# EAGLE schematic carret (EAGLE 5.11)
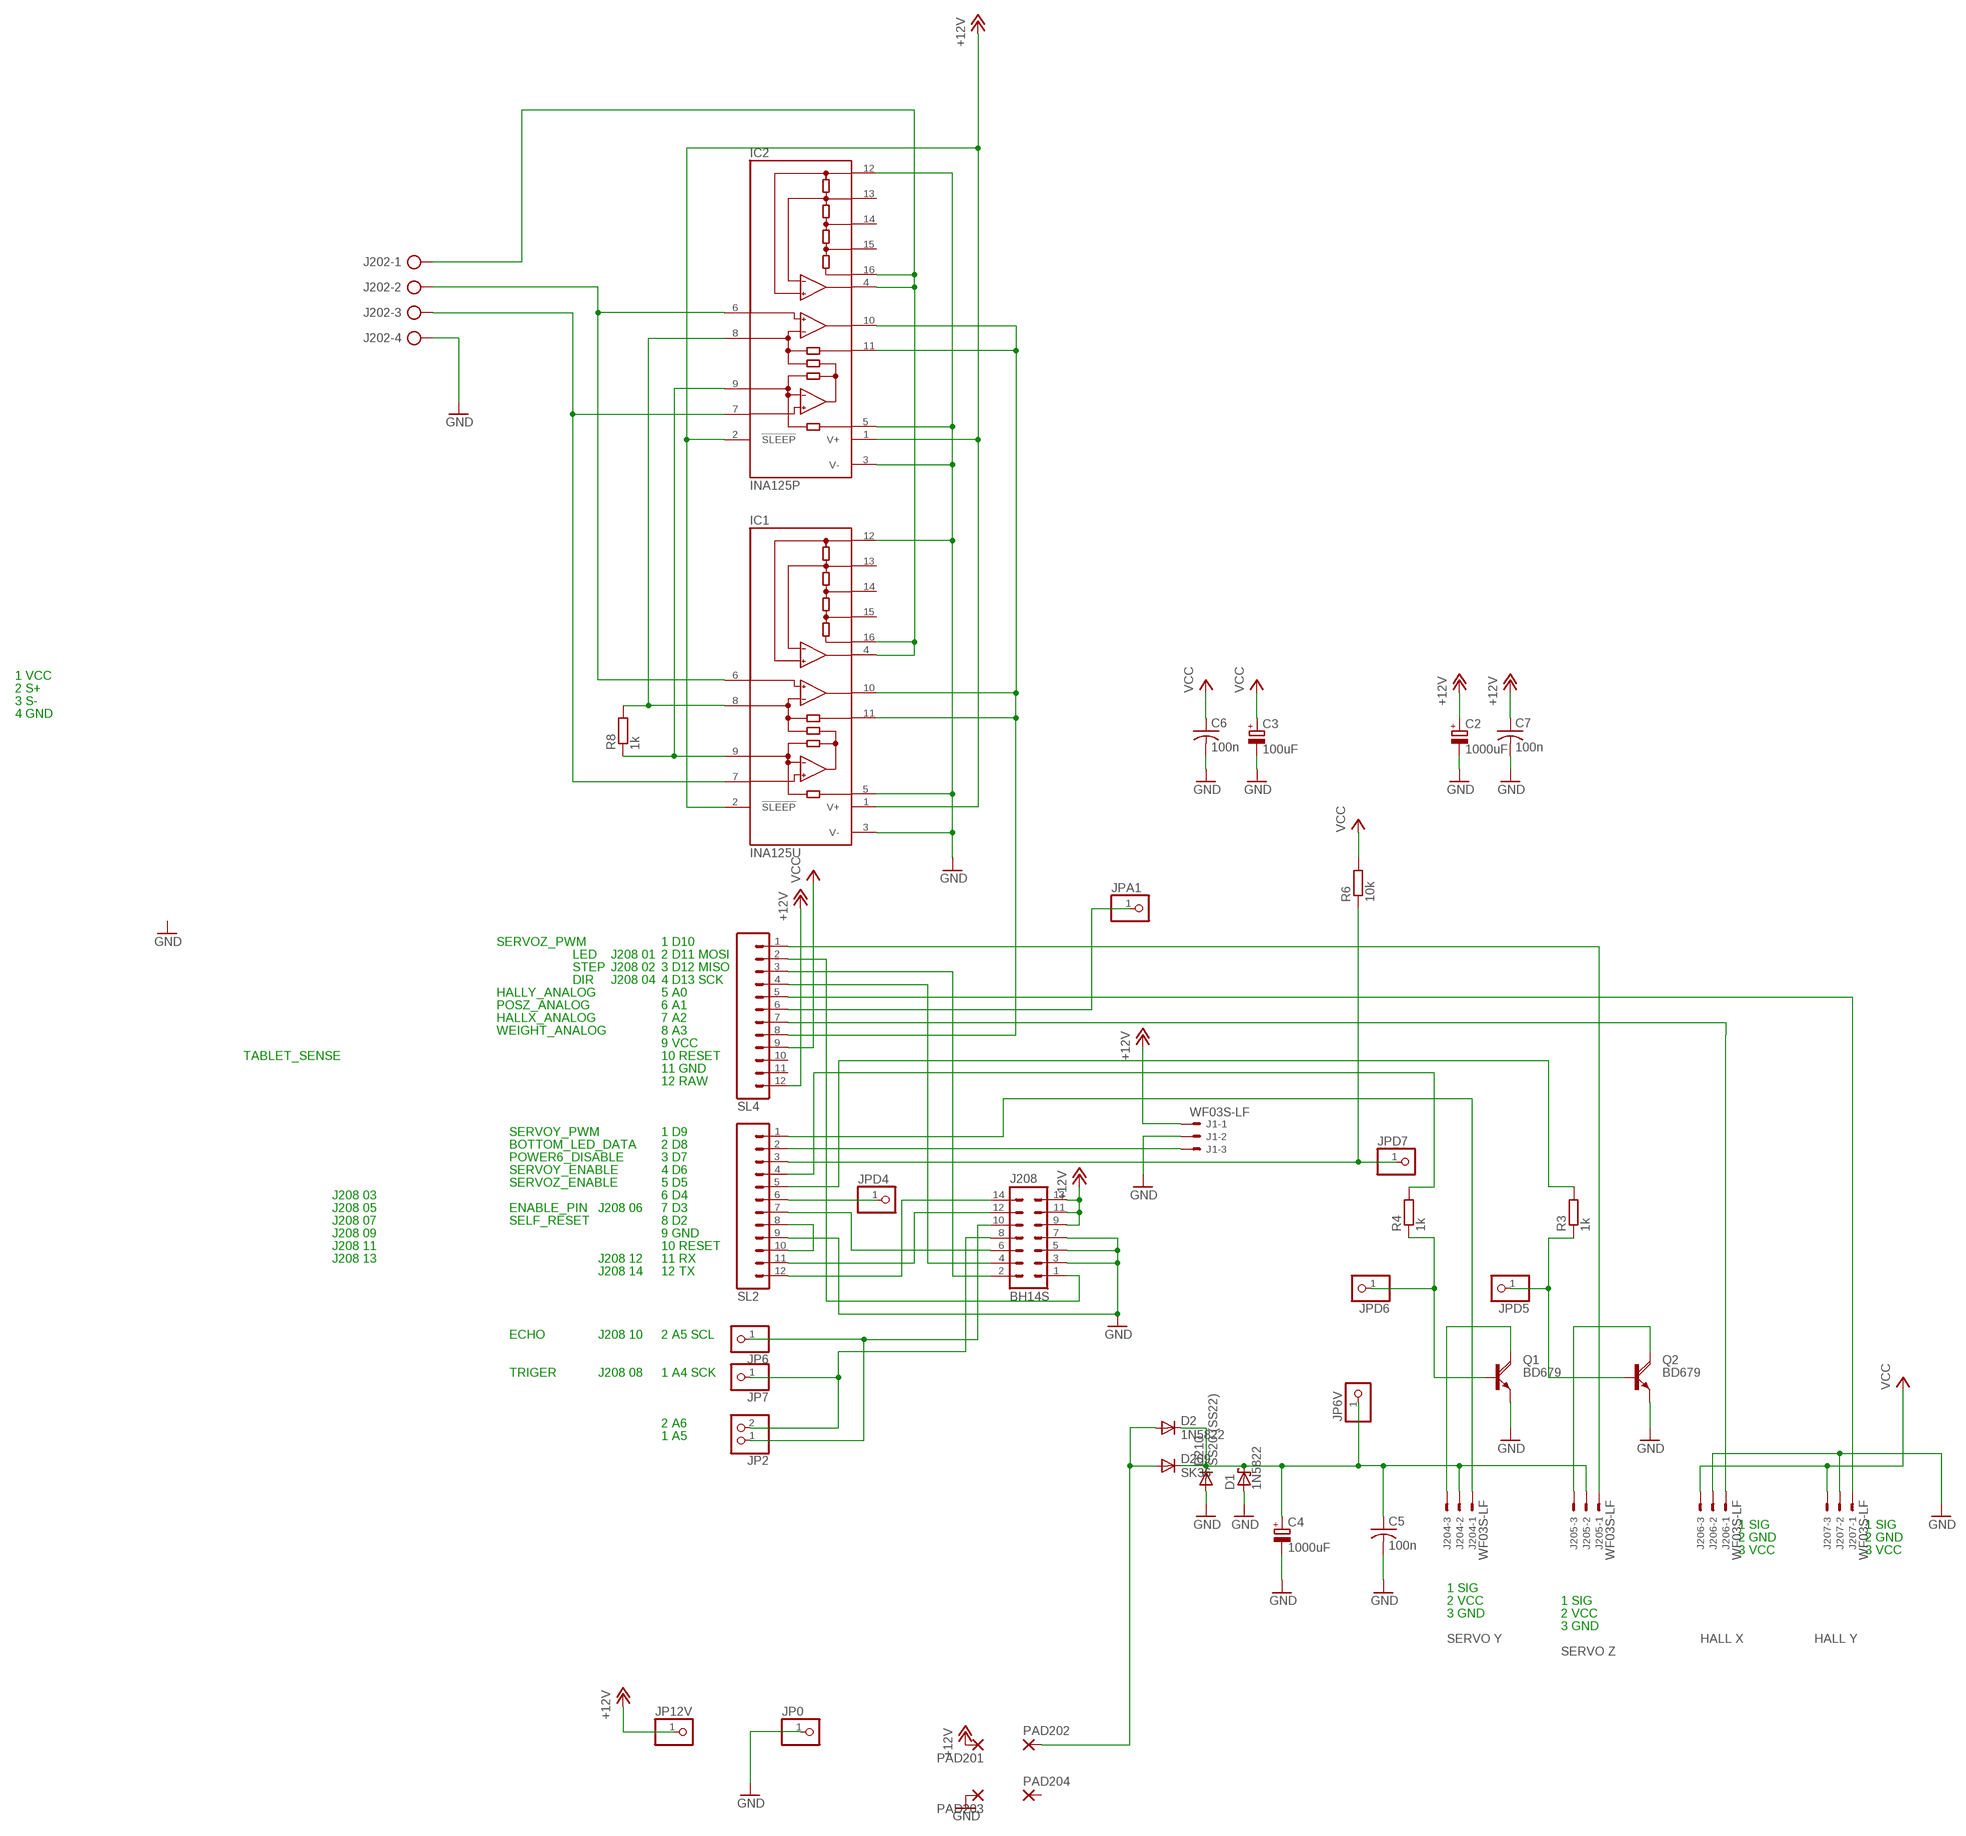
[diagram p0: schematic, sheet 1]

## Parts
C2  1000uF  CPOL-EUE3.5-8  [E3,5-8]
C3  100uF  CPOL-EUE3.5-8  [E3,5-8]
C4  1000uF  CPOL-EUE5-10.5  [E5-10,5]
C5  100n  C-US050-030X075  [C050-030X075]
C6  100n  C-US050-030X075  [C050-030X075]
C7  100n  C-US050-030X075  [C050-030X075]
D1  1N5822  1N5819-T  [DO41-7.6]
D2  1N5822  DIODE-DO201-15  [DO201-15]
D209  SK36  DIODE-SMC  [SMC]
D210  SS20 (SS22)  DIODE-DO214AA  [DO214AA]
IC1  INA125U  [SO16-1]
IC2  INA125P  [DIL16]
J1  WF03S-LF  22-27-2031-03  [6410-03]
J202  AK300/4  [AK300/4]
J204  WF03S-LF  22-27-2031-03  [6410-03]
J205  WF03S-LF  22-27-2031-03  [6410-03]
J206  WF03S-LF  22-27-2031-03  [6410-03]
J207  WF03S-LF  22-27-2031-03  [6410-03]
J208  BH14S  ML14  [ML14]
JP0  PINHD-1X1  [1X01]
JP2  PINHD-1X2  [1X02]
JP6  PINHD-1X1  [1X01]
JP6V  PINHD-1X1  [1X01]
JP7  PINHD-1X1  [1X01]
JP12V  PINHD-1X1  [1X01]
JPA1  PINHD-1X1  [1X01]
JPD4  PINHD-1X1  [1X01]
JPD5  PINHD-1X1  [1X01]
JPD6  PINHD-1X1  [1X01]
JPD7  PINHD-1X1  [1X01]
PAD201  3,81/1,1  [3,81/1,1]
PAD202  3,81/1,1  [3,81/1,1]
PAD203  3,81/1,1  [3,81/1,1]
PAD204  3,81/1,1  [3,81/1,1]
Q1  BD679  [TO126AV]
Q2  BD679  [TO126AV]
R3  1k  R-EU_0207/10  [0207/10]
R4  1k  R-EU_0207/10  [0207/10]
R6  10k  R-EU_0207/10  [0207/10]
R8  1k  R-EU_0207/10  [0207/10]
SL2  M12  [12P]
SL4  M12  [12P]

## Nets
+12V [power12]: C2.+ C7.1 IC1.1(V+) IC1.2(!SLEEP) IC2.1(V+) IC2.2(!SLEEP) J1.1 J208.9 J208.11 J208.13 JP12V.1 PAD201.1(P) SL4.12
GND [ground]: C2.- C3.- C4.- C5.2 C6.2 C7.2 D1.A D210.A IC1.3(V-) IC1.5(REF) IC1.12(REFCOM) IC2.3(V-) IC2.5(REF) IC2.12(REFCOM) J1.2 J202.4 J206.2 J207.2 J208.3 J208.5 J208.7 JP0.1 PAD203.1(P) Q1.E Q2.E SL2.9
N$1: JPD6.1 Q1.B R4.1
N$2: J208.14 SL2.12
N$3: J1.3 SL2.2
N$4: JPD7.1 R6.1 SL2.3
N$5: J206.1 SL4.7
N$6: J208.1 SL4.2
N$7: J208.12 SL2.11
N$8: J208.2 SL4.3
N$9: J208.10 JP2.1 JP6.1
N$10: J205.1 SL4.1
N$11: J208.8 JP2.2 JP7.1
N$12: J208.4 SL4.4
N$13: IC1.6(+IN) IC2.6(+IN) J202.2
N$14 [power12]: D2.A D209.A PAD202.1(P)
N$15: SL2.8 SL2.10
N$16: J207.1 SL4.5
N$17 [power6]: J204.3 Q1.C
N$18: R4.2 SL2.4
N$19: R3.2 SL2.5
N$20 [power6]: J205.3 Q2.C
N$21: J204.1 SL2.1
N$22 [power6]: C4.+ C5.1 D1.C D2.C D209.C D210.C J204.2 J205.2 JP6V.1
N$23: JPD5.1 Q2.B R3.1
N$24: JPD4.1 SL2.6
N$25: IC1.4(REFOUT) IC1.16(REF10) IC2.4(REFOUT) IC2.16(REF10) J202.1
N$26: IC1.7(-IN) IC2.7(-IN) J202.3
N$27: J208.6 SL2.7
N$28: JPA1.1 SL4.6
N$30: IC1.8(RG) IC2.8(RG) R8.2
N$31: IC1.9(RG) IC2.9(RG) R8.1
N$41: IC1.10(OUT) IC1.11(SENSE) IC2.10(OUT) IC2.11(SENSE) SL4.8
VCC [power5]: C3.+ C6.1 J206.3 J207.3 R6.2 SL4.9
Unconnected: IC1.13(REFBG) IC1.14(REF2.5) IC1.15(REF5) IC2.13(REFBG) IC2.14(REF2.5) IC2.15(REF5) PAD204.1(P) SL4.10 SL4.11

## Notes on the sheet
- 1 VCC
- 2 S+
- 3 S-
- 4 GND
- SERVOZ_PWM | 1 D10
- LED | J208 01 | 2 D11 MOSI
- STEP | J208 02 | 3 D12 MISO
- DIR | J208 04 | 4 D13 SCK
- HALLY_ANALOG | 5 A0
- POSZ_ANALOG | 6 A1
- HALLX_ANALOG | 7 A2
- WEIGHT_ANALOG | 8 A3
- 9 VCC
- TABLET_SENSE | 10 RESET
- 11 GND
- 12 RAW
- SERVOY_PWM | 1 D9
- BOTTOM_LED_DATA | 2 D8
- POWER6_DISABLE | 3 D7
- SERVOY_ENABLE | 4 D6
- SERVOZ_ENABLE | 5 D5
- J208 03 | 6 D4
- J208 05 | ENABLE_PIN | J208 06 | 7 D3
- J208 07 | SELF_RESET | 8 D2
- J208 09 | 9 GND
- J208 11 | 10 RESET
- J208 13 | J208 12 | 11 RX
- J208 14 | 12 TX
- ECHO | J208 10 | 2 A5 SCL
- TRIGER | J208 08 | 1 A4 SCK
- 2 A6
- 1 A5
- 1 SIG | 1 SIG
- 2 GND | 2 GND
- 3 VCC | 3 VCC
- 1 SIG
- 2 VCC | 1 SIG
- 3 GND | 2 VCC
- 3 GND
- SERVO Y | HALL X | HALL Y
- SERVO Z

## Library data of the parts
C2-C4 = rcl:CPOL-EU: POLARIZED CAPACITOR, European symbol
C5-C7 = resistor:C-US: CAPACITOR, American symbol
D1 = diode:1N581*: 1.0A SCHOTTKY BARRIER RECTIFIER Source: http://www.diodes.com/datasheets/ds23001.pdf
D2 D209 D210 = diode:DIODE-: DIODE
IC1 = burr-brown:INA125: Instrumentation Amplifier with Precision Voltage Reference; MF: TEXAS INSTRUMENT CONNECTORS; MPN: INA125U; OC_FARNELL: 1304375; OC_NEWARK: 80K5901
IC2 = burr-brown:INA125: Instrumentation Amplifier with Precision Voltage Reference; MF: TEXAS INSTRUMENT CONNECTORS; MPN: INA125P; OC_FARNELL: 1459461; OC_NEWARK: 35C1726
J1 J204-J207 = con-molex:22-?-03: CONNECTOR wire to board 2.54 mm (.1 inch) pitch header; OC_FARNELL: unknown; OC_NEWARK: unknown
J202 = con-ptr500:AK300/4: CONNECTOR; OC_FARNELL: unknown; OC_NEWARK: unknown
J208 = con-ml:ML14: HARTING; OC_FARNELL: unknown; OC_NEWARK: unknown
JP0 JP6 JP6V JP7 JP12V JPA1 JPD4-JPD7 = pinhead:PINHD-1X1: PIN HEADER
JP2 = pinhead:PINHD-1X2: PIN HEADER
PAD201-PAD204 = wirepad:3,81/1,1: THROUGH-HOLE PAD
Q1 Q2 = transistor-power:BD679: NPN DARLINGTON TRANSISTOR
R3 R4 R6 R8 = rcl:R-EU_: RESISTOR, European symbol
SL2 SL4 = con-amp-quick:M12: AMP QUICK CONNECTOR; OC_FARNELL: unknown; OC_NEWARK: unknown

## Net classes
0 default: width 0.381 mm, drill 0.254 mm, clearance 0.254 mm
1 power12: width 1.27 mm
2 ground: width 0.508 mm
3 power5: width 0.508 mm
4 power6: width 0.813 mm